# Altium schematic sheet BlockDiagram.SchDoc
size A; SheetNumber: 1; SheetTotal: 5
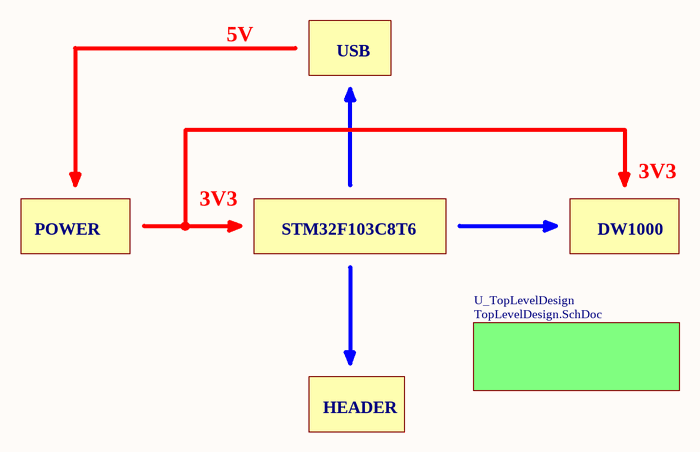
[diagram p0: BlockDiagram.SchDoc]

## Sub-sheets
U_TopLevelDesign = TopLevelDesign.SchDoc: no entries

## Notes on the sheet
- 5V
- USB
- POWER
- 3V3
- STM32F103C8T6
- DW1000
- HEADER